# EAGLE design MyCard_Ver9 (EAGLE 9.6.2)
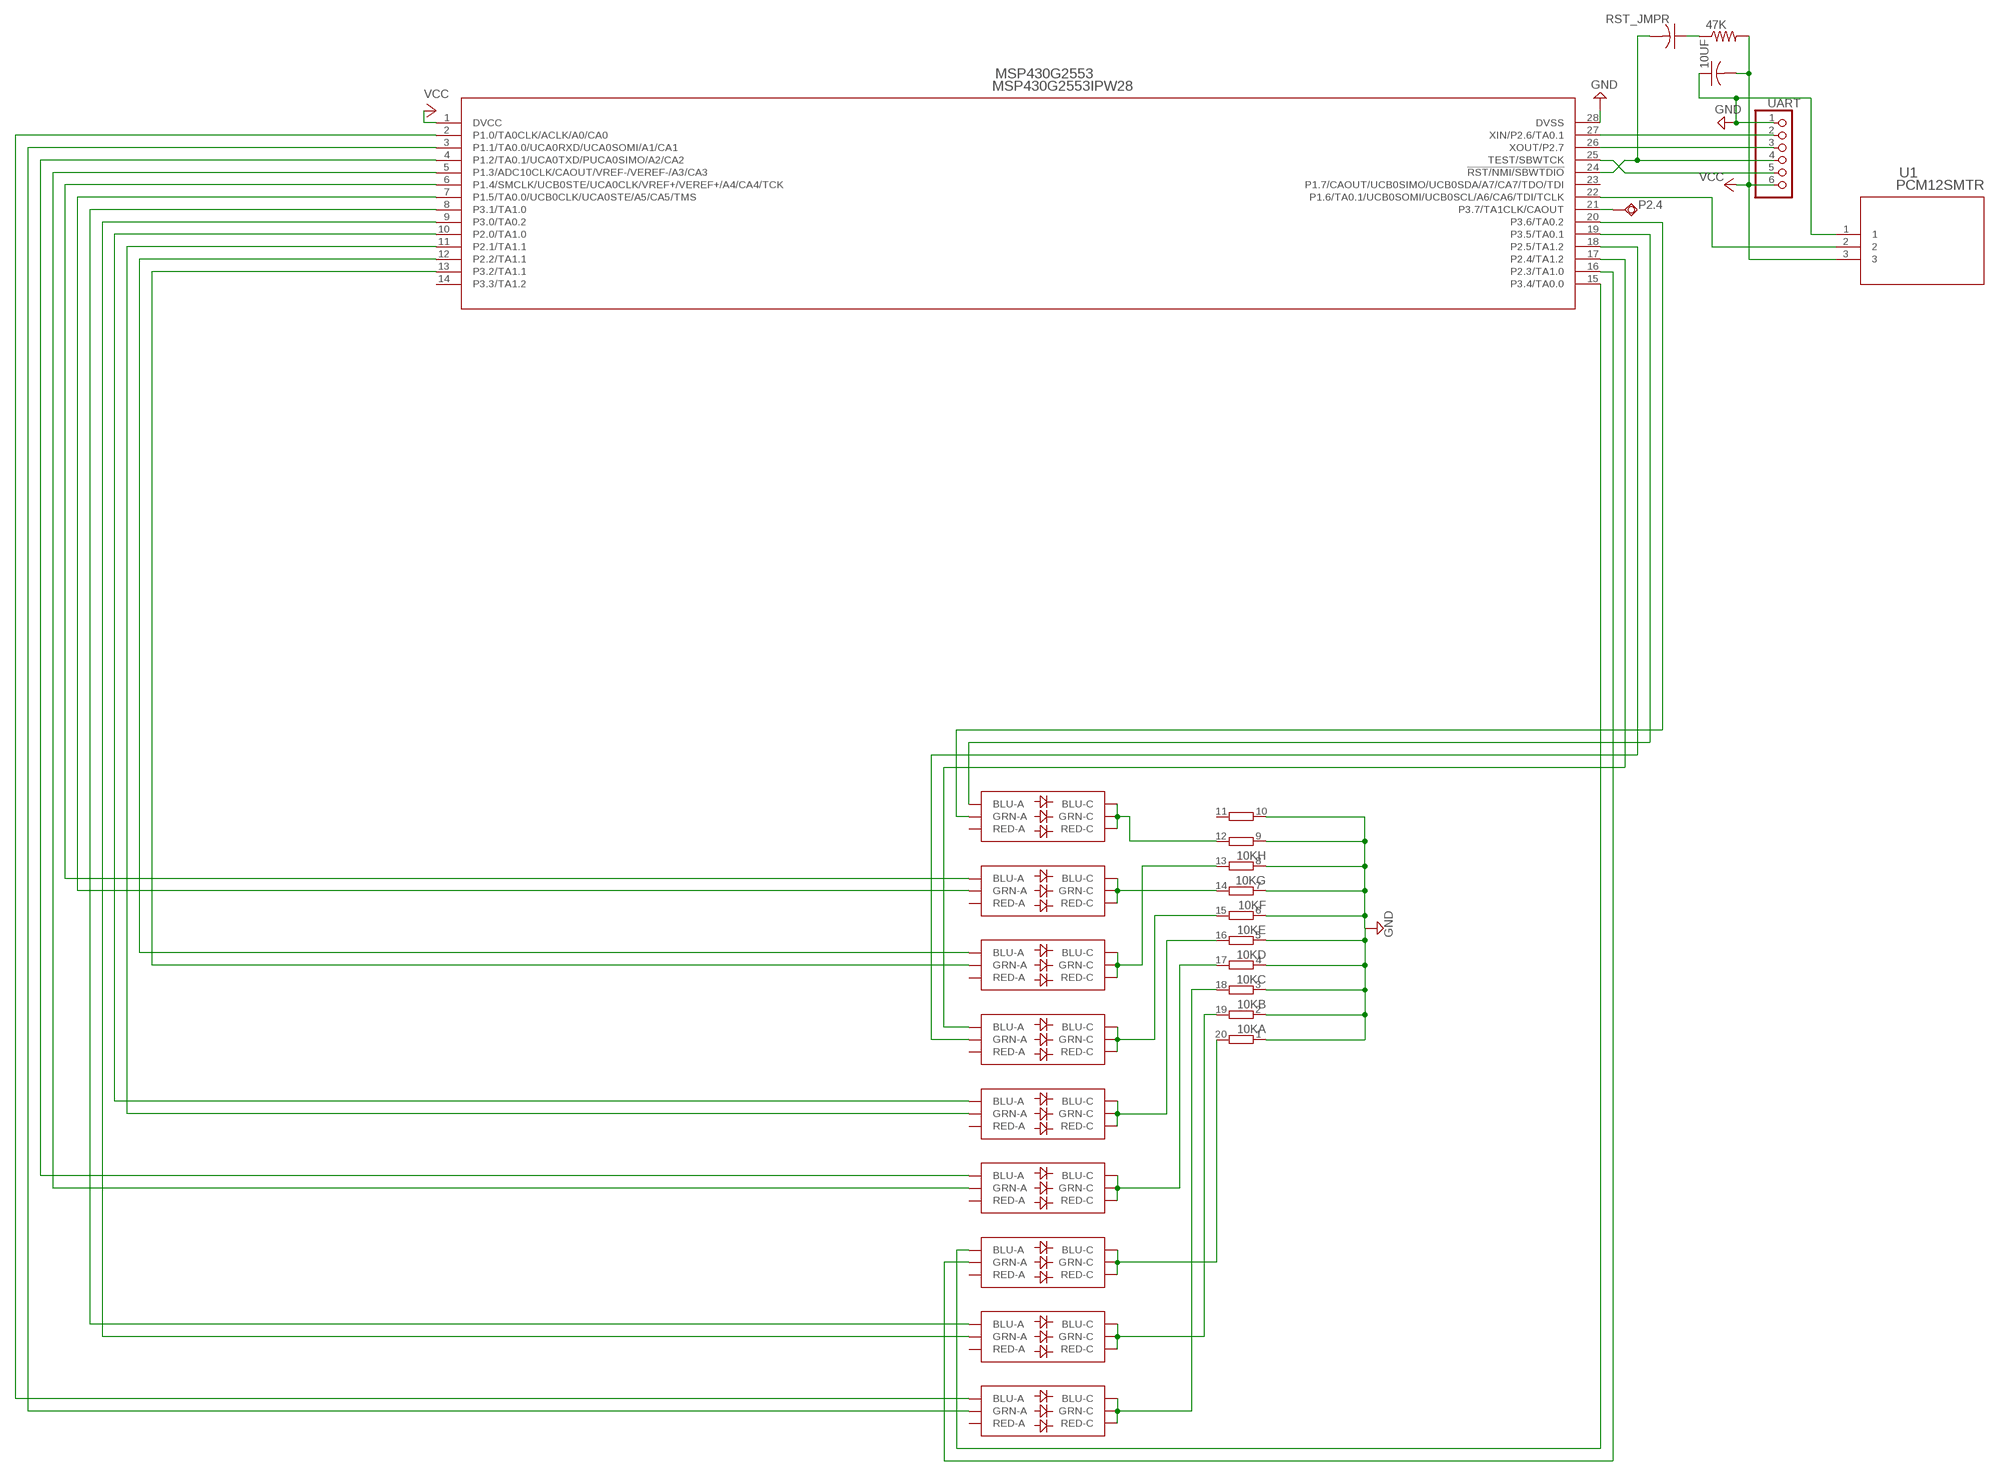
[diagram p0: schematic, sheet 1, part 1 of 2]
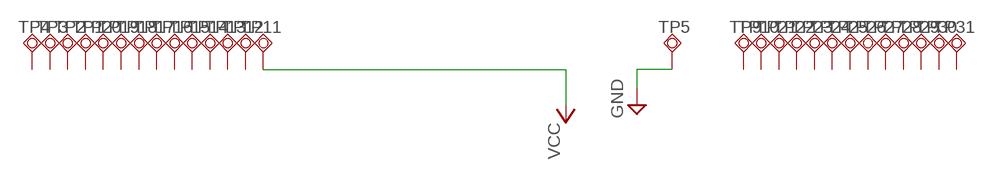
[diagram p1: schematic, sheet 1, part 2 of 2]

## Parts
0  RGB  LED-RGBPLCC-6  [PLCC-6-LED]
1  RGB  LED-RGBPLCC-6  [PLCC-6-LED]
2  RGB  LED-RGBPLCC-6  [PLCC-6-LED]
3  RGB  LED-RGBPLCC-6  [PLCC-6-LED]
4  RGB  LED-RGBPLCC-6  [PLCC-6-LED]
5  RGB  LED-RGBPLCC-6  [PLCC-6-LED]
6  RGB  LED-RGBPLCC-6  [PLCC-6-LED]
7  RGB  LED-RGBPLCC-6  [PLCC-6-LED]
8  RGB  LED-RGBPLCC-6  [PLCC-6-LED]
10K  10R-NSOMC  [SOMC20]
10UF  C-USC0805  [C0805]
47K  R-US_R0805  [R0805]
MSP430G2553  MSP430G2553IPW28  [PW28]
P2.4  TPSQTP20R  [TP20R]
RST_JMPR  C-USC0805  [C0805]
TP1  TPSQTP20SQ  [TP20SQ]
TP2  TPSQTP20SQ  [TP20SQ]
TP3  TPSQTP20SQ  [TP20SQ]
TP4  TPSQTP20SQ  [TP20SQ]
TP5  TPSQTP20SQ  [TP20SQ]
TP9  TPSQTP20SQ  [TP20SQ]
TP10  TPSQTP20SQ  [TP20SQ]
TP11  TPSQTP20SQ  [TP20SQ]
TP12  TPSQTP20SQ  [TP20SQ]
TP13  TPSQTP20SQ  [TP20SQ]
TP14  TPSQTP20SQ  [TP20SQ]
TP15  TPSQTP20SQ  [TP20SQ]
TP16  TPSQTP20SQ  [TP20SQ]
TP17  TPSQTP20SQ  [TP20SQ]
TP18  TPSQTP20SQ  [TP20SQ]
TP19  TPSQTP20SQ  [TP20SQ]
TP20  TPSQTP20SQ  [TP20SQ]
TP21  TPSQTP20SQ  [TP20SQ]
TP22  TPSQTP20SQ  [TP20SQ]
TP23  TPSQTP20SQ  [TP20SQ]
TP24  TPSQTP20SQ  [TP20SQ]
TP25  TPSQTP20SQ  [TP20SQ]
TP26  TPSQTP20SQ  [TP20SQ]
TP27  TPSQTP20SQ  [TP20SQ]
TP28  TPSQTP20SQ  [TP20SQ]
TP29  TPSQTP20SQ  [TP20SQ]
TP30  TPSQTP20SQ  [TP20SQ]
TP31  TPSQTP20SQ  [TP20SQ]
U1  PCM12SMTR  [PCM12SMTR_CNK]
UART  PINHD-1X6B  [1X06-BIG]

## Nets
GND: 10K.1 10K.2 10K.3 10K.4 10K.5 10K.6 10K.7 10K.8 10K.9 10K.10 10UF.1 MSP430G2553.28(DVSS) TP5.TP U1.1 UART.1
N$1: 1.CB(BLU-C) 1.CG(GRN-C) 1.CR(RED-C) 10K.19
N$2: MSP430G2553.21(P3.7/TA1CLK/CAOUT) P2.4.TP
N$3: 8.CB(BLU-C) 8.CG(GRN-C) 8.CR(RED-C) 10K.12
N$4: 0.CB(BLU-C) 0.CG(GRN-C) 0.CR(RED-C) 10K.18
N$5: MSP430G2553.27(XIN/P2.6/TA0.1) UART.2
N$6: MSP430G2553.26(XOUT/P2.7) UART.3
N$7: 3.CB(BLU-C) 3.CG(GRN-C) 3.CR(RED-C) 10K.17
N$8: 0.AB(BLU-A) MSP430G2553.2(P1.0/TA0CLK/ACLK/A0/CA0)
N$9: 0.AG(GRN-A) MSP430G2553.3(P1.1/TA0.0/UCA0RXD/UCA0SOMI/A1/CA1)
N$10: 3.AB(BLU-A) MSP430G2553.4(P1.2/TA0.1/UCA0TXD/PUCA0SIMO/A2/CA2)
N$11: 3.AG(GRN-A) MSP430G2553.5(P1.3/ADC10CLK/CAOUT/VREF-/VEREF-/A3/CA3)
N$12: 4.CB(BLU-C) 4.CG(GRN-C) 4.CR(RED-C) 10K.16
N$13: 5.CB(BLU-C) 5.CG(GRN-C) 5.CR(RED-C) 10K.15
N$14: 6.AB(BLU-A) MSP430G2553.6(P1.4/SMCLK/UCB0STE/UCA0CLK/VREF+/VEREF+/A4/CA4/TCK)
N$15: 6.AG(GRN-A) MSP430G2553.7(P1.5/TA0.0/UCB0CLK/UCA0STE/A5/CA5/TMS)
N$16: 1.AB(BLU-A) MSP430G2553.8(P3.1/TA1.0)
N$17: 1.AG(GRN-A) MSP430G2553.9(P3.0/TA0.2)
N$18: 6.CB(BLU-C) 6.CG(GRN-C) 6.CR(RED-C) 10K.14
N$19: 4.AB(BLU-A) MSP430G2553.10(P2.0/TA1.0)
N$20: 7.CB(BLU-C) 7.CG(GRN-C) 7.CR(RED-C) 10K.13
N$21: 4.AG(GRN-A) MSP430G2553.11(P2.1/TA1.1)
N$22: 7.AB(BLU-A) MSP430G2553.12(P2.2/TA1.1)
N$23: 7.AG(GRN-A) MSP430G2553.13(P3.2/TA1.1)
N$24: 47K.1 RST_JMPR.1
N$25: 2.AB(BLU-A) MSP430G2553.15(P3.4/TA0.0)
N$26: 2.AG(GRN-A) MSP430G2553.16(P2.3/TA1.0)
N$27: 5.AB(BLU-A) MSP430G2553.17(P2.4/TA1.2)
N$28: 5.AG(GRN-A) MSP430G2553.18(P2.5/TA1.2)
N$29: 8.AB(BLU-A) MSP430G2553.19(P3.5/TA0.1)
N$30: 8.AG(GRN-A) MSP430G2553.20(P3.6/TA0.2)
N$31: MSP430G2553.22(P1.6/TA0.1/UCB0SOMI/UCB0SCL/A6/CA6/TDI/TCLK) U1.2
N$44: 2.CB(BLU-C) 2.CG(GRN-C) 2.CR(RED-C) 10K.20
RST: MSP430G2553.24(!RST/NMI/SBWTDIO) RST_JMPR.2 UART.4
TEST: MSP430G2553.25(TEST/SBWTCK) UART.5
VCC: 10UF.2 47K.2 MSP430G2553.1(DVCC) TP11.TP U1.3 UART.6
Unconnected: 0.AR(RED-A) 1.AR(RED-A) 2.AR(RED-A) 3.AR(RED-A) 4.AR(RED-A) 5.AR(RED-A) 6.AR(RED-A) 7.AR(RED-A) 8.AR(RED-A) 10K.11 MSP430G2553.14(P3.3/TA1.2) MSP430G2553.23(P1.7/CAOUT/UCB0SIMO/UCB0SDA/A7/CA7/TDO/TDI) TP1.TP TP2.TP TP3.TP TP4.TP TP9.TP TP10.TP TP12.TP TP13.TP TP14.TP TP15.TP TP16.TP TP17.TP TP18.TP TP19.TP TP20.TP TP21.TP TP22.TP TP23.TP TP24.TP TP25.TP TP26.TP TP27.TP TP28.TP TP29.TP TP30.TP TP31.TP

## Library data of the parts
0 1-8 = SparkFun-LED:LED-RGB: LED-RGB 6 pin RGB LED (no common connector) Packages: PLCC-6 LED-TRICOLOR-5050 - No built-in IC SparkFun Products: Digital Sandbox <https://www.sparkfun.com/products/12651> LED- SMD RGB <https://www.sparkfun.com/products/10866>; PROD_ID: DIO-12113
10K = resistor-dil:10R-N: DIL RESISTOR; OC_FARNELL: unknown; OC_NEWARK: unknown
10UF RST_JMPR = adafruit:C-US: CAPACITOR, American symbol
47K = adafruit:R-US_: RESISTOR, American symbol
MSP430G2553 = MSP430G2553IPW28:MSP430G2553IPW28: MSP430G2553IPW28; COPYRIGHT: Copyright (C) 2023 Ultra Librarian. All rights reserved.; MANUFACTURER_PART_NUMBER: MSP430G2553IPW28; MFR_NAME: Texas Instruments
P2.4 TP1-TP5 TP9-TP31 = testpad:TPSQ: Test pad
U1 = Slide Switch:PCM12SMTR: Slide Switch; COPYRIGHT: Copyright (C) 2023 Ultra Librarian. All rights reserved.; DIGI-KEY_PART_NUMBER_1: 401-2016-2-ND; DIGI-KEY_PART_NUMBER_2: 401-2016-1-ND; DIGI-KEY_PART_NUMBER_3: 401-2016-6-ND; DIGI-KEY_PART_NUMBER_4: 2266-PCM12SMTR-ND; MANUFACTURER_PART_NUMBER: PCM12SMTR; MFR_NAME: C&K Components
UART = adafruit:PINHD-1X6: PIN HEADER

## Board
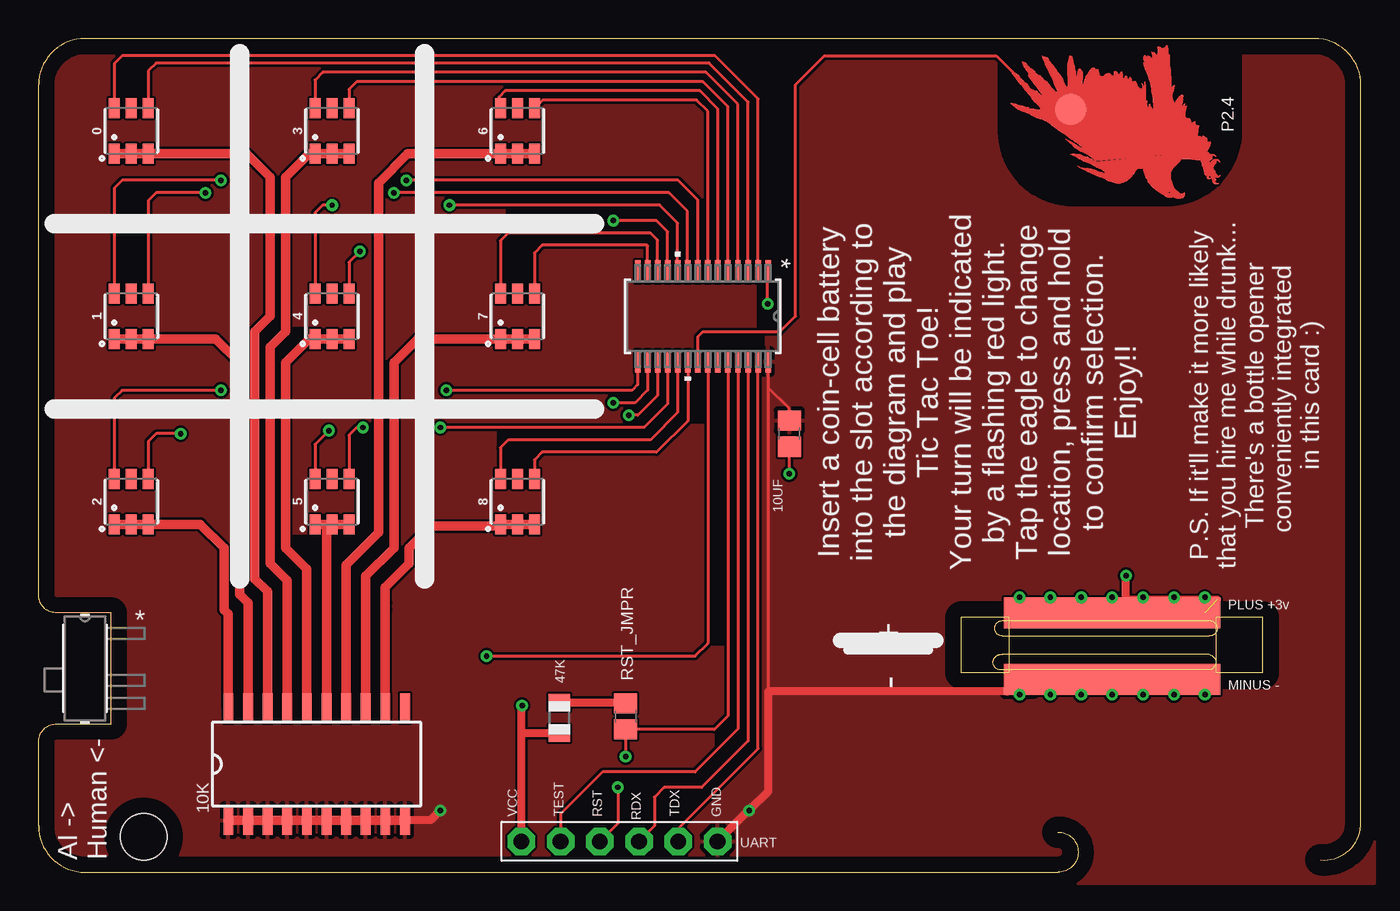
[diagram p2: board, top side]
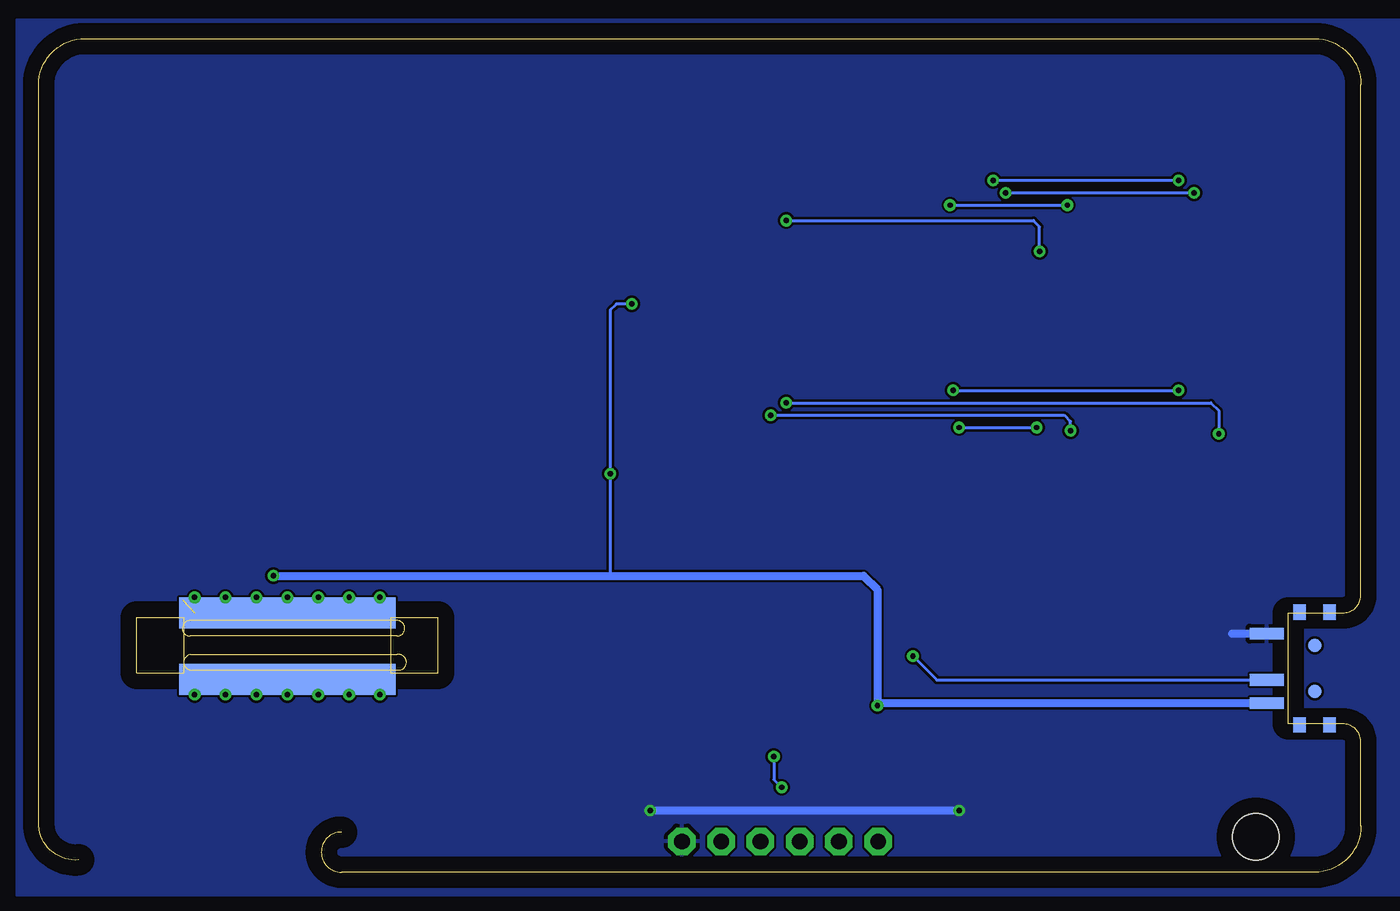
[diagram p3: board, bottom side, seen from below]

Size 85.6 x 53.98 mm. Coordinates in mm from the lower left corner, seen from the top.
Outline: 83,0.8 arc90 85.6,3 85.6,50.98 arc90 82.6,53.98 3,53.98 arc90 0,50.98 0,17.89 arc90 1.19,16.8 4.7,16.8 4.7,9.6 1.19,9.6 arc90 0,8.51 0,3 arc90 3,0 66,0 arc180 66,2.6
Outline: 59.75,12.9 59.75,16.5 62.8,16.5 62.8,12.9 59.75,12.9
Outline: 79.25,12.9 79.25,16.5 76.2,16.5 76.2,12.9 79.25,12.9
Outline: 62.4,16.3 75.8,16.3 arc-180 75.8,15.3 62.4,15.3 arc-180 62.4,16.3
Outline: 75.6,13.1 62.2,13.1 arc-180 62.4,14.1 75.8,14.1 arc-180 75.6,13.1
Copper layers (1*16): Top 0.035mm / dielectric 1.5mm / Bottom 0.035mm
Design rules "default": minimum track width 6mil, minimum drill 0.35mm, track to track 6mil, track to pad 6mil, pad to pad 6mil, via to via 6mil, smd to smd 6mil, copper to edge 40mil, drill to drill 6mil, minimum pad ring 10mil, minimum via ring 8mil, stop-mask expansion 4mil, vias tented up to drill 0mil, thermal gap 10mil
Holes 3 mm at 6.8,2.3
tRestrict: area 12.7,9.6 to 13.1,9.7; area 14,9.6 to 14.4,9.7; area 15.3,9.6 to 15.7,9.7; area 16.5,9.6 to 17,9.7; area 17.8,9.6 to 18.2,9.7; area 19,9.6 to 19.5,9.7; area 20.3,9.6 to 20.8,9.7; area 21.6,9.6 to 22,9.7; area 46.5,35.2 to 46.7,38.1; area 46.9,34 to 47,34.8; area 29.7,27.6 to 29.8,28.6; area 20.5,23.2 to 20.6,24.8; 6 more areas

### Footprints (pad centres in the part's own frame; a part is rotated, then mirrored left to right if it is on the bottom)
PLCC-6-LED = smd 1.3 x 0.7: AB 1.475,1.1; AG 1.475,-1.1; AR 1.475,0; CB -1.475,1.1; CG -1.475,-1.1; CR -1.475,0
SOMC20 = smd 1.91 x 0.64: 1 -3.62,5.715; 2 -3.62,4.445; 3 -3.62,3.175; 4 -3.62,1.905; 5 -3.62,0.635; 6 -3.62,-0.635; 7 -3.62,-1.905; 8 -3.62,-3.175; 9 -3.62,-4.445; 10 -3.62,-5.715; 11 3.62,-5.715; 12 3.62,-4.445; 13 3.62,-3.175; 14 3.62,-1.905; 15 3.62,-0.635; 16 3.62,0.635; 17 3.62,1.905; 18 3.62,3.175; 19 3.62,4.445; 20 3.62,5.715
C0805 = smd 1.3 x 1.5: 1 -0.85,0; 2 0.85,0
R0805 = smd 1.1 x 1.4: 1 -1,0; 2 1,0
PW28 = smd 1.462 x 0.355: 1 -2.921,4.225; 2 -2.921,3.575; 3 -2.921,2.925; 4 -2.921,2.275; 5 -2.921,1.625; 6 -2.921,0.975; 7 -2.921,0.325; 8 -2.921,-0.325; 9 -2.921,-0.975; 10 -2.921,-1.625; 11 -2.921,-2.275; 12 -2.921,-2.925; 13 -2.921,-3.575; 14 -2.921,-4.225; 15 2.921,-4.225; 16 2.921,-3.575; 17 2.921,-2.925; 18 2.921,-2.275; 19 2.921,-1.625; 20 2.921,-0.975; 21 2.921,-0.325; 22 2.921,0.325; 23 2.921,0.975; 24 2.921,1.625; 25 2.921,2.275; 26 2.921,2.925; 27 2.921,3.575; 28 2.921,4.225
TP20R = smd 2 x 2: TP 0,0
TP20SQ = smd 2 x 2: TP 0,0
PCM12SMTR_CNK = smd 2.21 x 0.762 bottom: 1 3.101,2.25; 2 3.101,-0.75; 3 3.101,-2.25 | smd 0.889 x 0.889 bottom: 4 0,1.5; 5 0,-1.5 | smd 0.813 x 0.991 bottom: 6 -0.965,3.65; 7 0.965,3.65; 8 -0.965,-3.65; 9 0.965,-3.65
1X06-BIG = drill 1.016 pad 1.778 octagon: 1 -6.35,0; 2 -3.81,0; 3 -1.27,0; 4 1.27,0; 5 3.81,0; 6 6.35,0

### Placement (x,y rotation side)
0  6,48 90 top
1  6,36 90 top
2  6,24 90 top
3  19,48 90 top
4  19,36 90 top
5  19,24 90 top
6  31,48 90 top
7  31,36 90 top
8  31,24 90 top
10K  18,7 90 top
10UF  48.6,28.4 270 top
47K  33.7,10 270 top
MSP430G2553  43,36 270 top
P2.4  66.8,49.4 90 top
RST_JMPR  38,10.1 270 top
TP1  65.5,16.8 180 bottom
TP2  71.5,16.8 180 bottom
TP3  63.5,16.8 0 bottom
TP4  67.5,16.8 0 bottom
TP5  63.5,12.5 0 top
TP9  69.5,12.5 180 bottom
TP10  73.5,12.5 0 bottom
TP11  75.5,16.8 180 top
TP12  71.5,16.8 180 top
TP13  75.5,16.8 180 bottom
TP14  73.5,16.8 180 bottom
TP15  69.5,16.8 180 bottom
TP16  73.5,16.8 180 top
TP17  69.5,16.8 180 top
TP18  65.5,16.8 180 top
TP19  63.5,16.8 180 top
TP20  67.5,16.8 180 top
TP21  65.5,12.5 0 top
TP22  69.5,12.5 0 top
TP23  75.5,12.5 0 top
TP24  73.5,12.5 0 top
TP25  67.5,12.5 180 top
TP26  71.5,12.5 180 top
TP27  71.5,12.5 0 bottom
TP28  63.5,12.5 180 bottom
TP29  67.5,12.5 0 bottom
TP30  75.5,12.5 180 bottom
TP31  65.5,12.5 180 bottom
U1  3,13.2 0 top
U$2  [EAGLE-TOP-10MM]  76.5,43.6 90 top
UART  37.6,2 180 top

### Tracks (layer width: path | path; a pad name or v marks a point on that pad's centre or on a via)
GND  (via drill 0.35)
  Top 0.2: TP5.TP 62.7,11.7 | 45.95,4 v46,4 | MSP430G2553.28 47.23,31.4 | 10UF.1 48.6,30.02 47.23,31.4 | 47.23,31.4 47.23,11.7
  Top 0.508: UART.1 45.95,4 | v26,4 25.38,3.38 10K.10 | v46,4 47.23,5.22 47.23,11.7 62.7,11.7
  Top 0.61: 10K.10 10K.9 10K.8 10K.7 10K.6 10K.5 10K.4 10K.3 10K.2 10K.1
  Bottom 0.508: v46,4 v26,4 | U1.1 8.35,15.45
  pour Top: 78,54.5 78,48 arc-90 73,43 67,43 arc-90 62,48 62,54.5 -1.9,54.5 -1.9,-0.7 86.5,-0.7 86.5,54.5
  pour Bottom: -2.6,-1.5 -2.6,55.2 87,55.2 87,-1.5
N$1
  Top 0.61: 1.CB 1.CR 1.CG 11.47,34.52 13,33 13,18 13.55,17.45 10K.19
N$2
  Top 0.2: MSP430G2553.21 42.67,34.67 43,35 48,35 49,36 49,51 50.86,52.86 62,52.86 65.46,49.4 P2.4.TP
N$3
  Top 0.61: 8.CG 8.CR 8.CB 30,22.43 25.43,22.43 24,21 24,20 22.45,18.45 22.45,17.45 22.45,17 10K.12
N$4
  Top 0.61: 0.CB 0.CR 0.CG 13.47,46.52 15,45 15,36 14,35 14,19 14.82,18.18 10K.18
N$5
  Top 0.2: MSP430G2553.27 46.58,8 41.41,2.83 UART.2
N$6
  Top 0.2: MSP430G2553.26 45.92,8.5 42.92,5.5 40.5,5.5 39.87,4.87 39.87,3 UART.3
N$7
  Top 0.61: 3.CG 3.CR 3.CB 17.52,46.52 16,45 16,35 15,34 15,20 16.09,18.91 10K.17
N$8
  Top 0.2: MSP430G2553.2 46.58,50.09 43.8,52.86 5.4,52.86 4.9,52.36 0.AB
N$9
  Top 0.2: MSP430G2553.3 45.92,49.88 43.4,52.4 7.6,52.4 7.1,51.9 0.AG
N$10
  Top 0.2: MSP430G2553.4 45.27,49.73 43.2,51.8 18.4,51.8 17.9,51.3 3.AB
N$11
  Top 0.2: MSP430G2553.5 44.62,49.58 43,51.2 20.6,51.2 20.1,50.7 3.AG
N$12
  Top 0.508: 17.52,34.52 4.CB
  Top 0.61: 10K.16 17.36,19.64 16,21 16,33 17.52,34.52 | 4.CG 4.CR 4.CB
N$13
  Top 0.61: 10K.15 18.64,22.16 5.CR | 5.CB 5.CR | 5.CR 5.CG
N$14
  Top 0.2: MSP430G2553.6 43.98,49.42 42.8,50.6 30.2,50.6 29.8,50.2 29.8,49.58 6.AB
N$15
  Top 0.2: MSP430G2553.7 43.33,49.27 42.6,50 32.62,50 6.AG
N$16  (via drill 0.35)
  Top 0.2: MSP430G2553.8 42.67,43.52 41.4,44.8 v23.8,44.8 | v11.8,44.8 5.4,44.8 4.9,44.3 1.AB
  Bottom 0.2: v23.8,44.8 v11.8,44.8
N$17  (via drill 0.35)
  Top 0.2: MSP430G2553.9 42,38.95 42,42.8 40.8,44 v23,44 | v10.8,44 7.6,44 7.1,43.5 1.AG
  Bottom 0.2: v23,44 v10.8,44
N$18
  Top 0.61: 6.CG 6.CR 6.CB 23.9,46.52 22,44.62 22,22 19.91,19.91 10K.14
N$19  (via drill 0.35)
  Top 0.2: MSP430G2553.10 41.38,42.02 40.2,43.2 v26.6,43.2 | v19,43.2 18.4,43.2 17.9,42.7 4.AB
  Bottom 0.2: v26.6,43.2 v19,43.2
N$20
  Top 0.61: 7.CG 7.CR 7.CB 24.52,34.52 23,33 23,21 21.18,19.18 10K.13
N$21  (via drill 0.35)
  Top 0.2: MSP430G2553.11 40.73,41.48 40,42.2 v37.2,42.2 | v20.8,40.2 20.1,39.5 4.AG
  Bottom 0.2: v20.8,40.2 20.8,41.8 21.2,42.2 v37.2,42.2
N$22
  Top 0.2: MSP430G2553.12 40.08,40.92 39.6,41.4 30.4,41.4 29.9,40.9 7.AB
N$23
  Top 0.2: MSP430G2553.13 39.42,40.58 39.4,40.6 32.6,40.6 32.1,40.1 7.AG
N$24
  Top 0.508: 47K.1 37.95,11 RST_JMPR.1
N$25  (via drill 0.35)
  Top 0.2: MSP430G2553.15 38.77,31.57 38.4,31.2 v26.4,31.2 | v11.8,31.2 5.4,31.2 4.9,30.7 2.AB
  Bottom 0.2: v26.4,31.2 v11.8,31.2
N$26  (via drill 0.35)
  Top 0.2: MSP430G2553.16 39.42,31.23 38.6,30.4 v37.2,30.4 | v9.2,28.4 7.6,28.4 7.1,27.9 2.AG
  Bottom 0.2: v37.2,30.4 9.7,30.4 9.2,29.9 v9.2,28.4
N$27  (via drill 0.35)
  Top 0.2: MSP430G2553.17 40.08,30.88 38.8,29.6 v38.2,29.6 | v18.8,28.6 17.9,27.7 5.AB
  Bottom 0.2: v38.2,29.6 19.2,29.6 18.8,29.2 v18.8,28.6
N$28  (via drill 0.35)
  Top 0.2: MSP430G2553.18 40.73,30.32 39.2,28.8 v26,28.8 | v21,28.8 20.6,28.8 20.1,28.3 5.AG
  Bottom 0.2: v26,28.8 v21,28.8
N$29
  Top 0.2: MSP430G2553.19 41.38,29.77 39.6,28 30.4,28 29.9,27.5 8.AB
N$30
  Top 0.2: MSP430G2553.20 42.02,29.23 40,27.2 32.6,27.2 32.1,26.7 8.AG
N$31  (via drill 0.35)
  Top 0.2: MSP430G2553.22 43.33,14.82 42.5,14 v29,14
  Bottom 0.2: v29,14 27.45,12.45 U1.2
N$44
  Top 0.61: 2.CB 2.CR 2.CG 10.47,22.52 12,21 12,17 12.29,16.71 10K.20
N$47  (via drill 0.35)
  other vias: 63.5,17.8
N$48  (via drill 0.35)
  other vias: 65.5,17.8
N$49  (via drill 0.35)
  other vias: 67.5,17.8
N$50  (via drill 0.35)
  other vias: 69.5,17.8
N$51  (via drill 0.35)
  other vias: 71.5,17.8
N$52  (via drill 0.35)
  other vias: 73.5,17.8
N$53  (via drill 0.35)
  other vias: 75.5,17.8
N$59  (via drill 0.35)
  other vias: 73.5,11.5
N$60  (via drill 0.35)
  other vias: 75.5,11.5
N$61  (via drill 0.35)
  other vias: 71.5,11.5
N$62  (via drill 0.35)
  other vias: 69.5,11.5
N$63  (via drill 0.35)
  other vias: 67.5,11.5
N$64  (via drill 0.35)
  other vias: 65.5,11.5
N$65  (via drill 0.35)
  other vias: 63.5,11.5
RST  (via drill 0.35)
  Top 0.2: MSP430G2553.24 44.62,10.12 43.75,9.25 RST_JMPR.2 v38,7.5 | v37.5,5.5 37.5,3.17 UART.4
  Bottom 0.2: v38,7.5 38,6 v37.5,5.5
TEST
  Top 0.2: UART.5 33.79,3.79 36.5,6.5 42.5,6.5 45.27,9.28 MSP430G2553.25
VCC  (via drill 0.35)  (1 unrouted)
  Top 0.2: v47.2,36.8 47.2,38.9 MSP430G2553.1 | v48.6,25.8 10UF.2
  Top 0.508: 76.28,17.65 70.55,17.65 70.4,17.8 v70.4,19.2 | v31.3,10.8 31.25,10.75 31.25,9 | UART.6 31.25,9 | 47K.2 31.25,9
  Bottom 0.2: v47.2,36.8 48.2,36.8 48.6,36.4 v48.6,25.8 48.6,19.2
  Bottom 0.508: v70.4,19.2 48.6,19.2 32.2,19.2 31.3,18.3 v31.3,10.8 31.15,10.95 U1.3

### Text on the board
tNames: Insert a coin-cell battery / into the slot according to / the diagram and play / Tic Tac Toe! / Your turn will be indicated / by a flashing red light. / Tap the eagle to change / location, press and hold / to confirm selection. / Enjoy!! | P.S. If it'll make it more likely / that you hire me while drunk... / There's a bottle opener / conveniently integrated / in this card :) | PLUS +3v | - + | MINUS - | RDX | VCC | TEST | RST | TDX | GND | AI -> / Human <-
tStop: 29/4/2023
bStop: Play against AI <- | Play against a friend <-
Document: CUT OUT & / PLATED EDGES